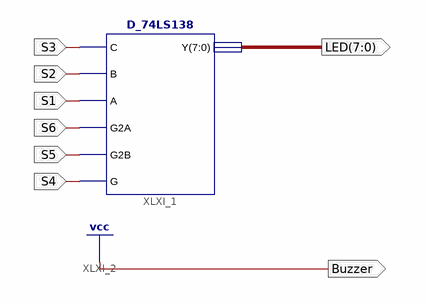
[diagram p0: schematic sheet 1]
// Xilinx ISE schematic D_74LS138_Test.sch (kintex7) as structural Verilog: 1 symbols, 8 ports
module D_74LS138_Test (
  input  S3,
  input  S2,
  input  S1,
  input  S6,
  input  S5,
  input  S4,
  output Buzzer,
  output [7:0] LED
);

  D_74LS138 XLXI_1 (.C(S3), .B(S2), .A(S1), .G2A(S6), .G2B(S5), .G(S4), .Y(LED));

  assign Buzzer = 1'b1;
endmodule
